# EAGLE design BEP3_RPM_BAR_multi (EAGLE 6.5.0)
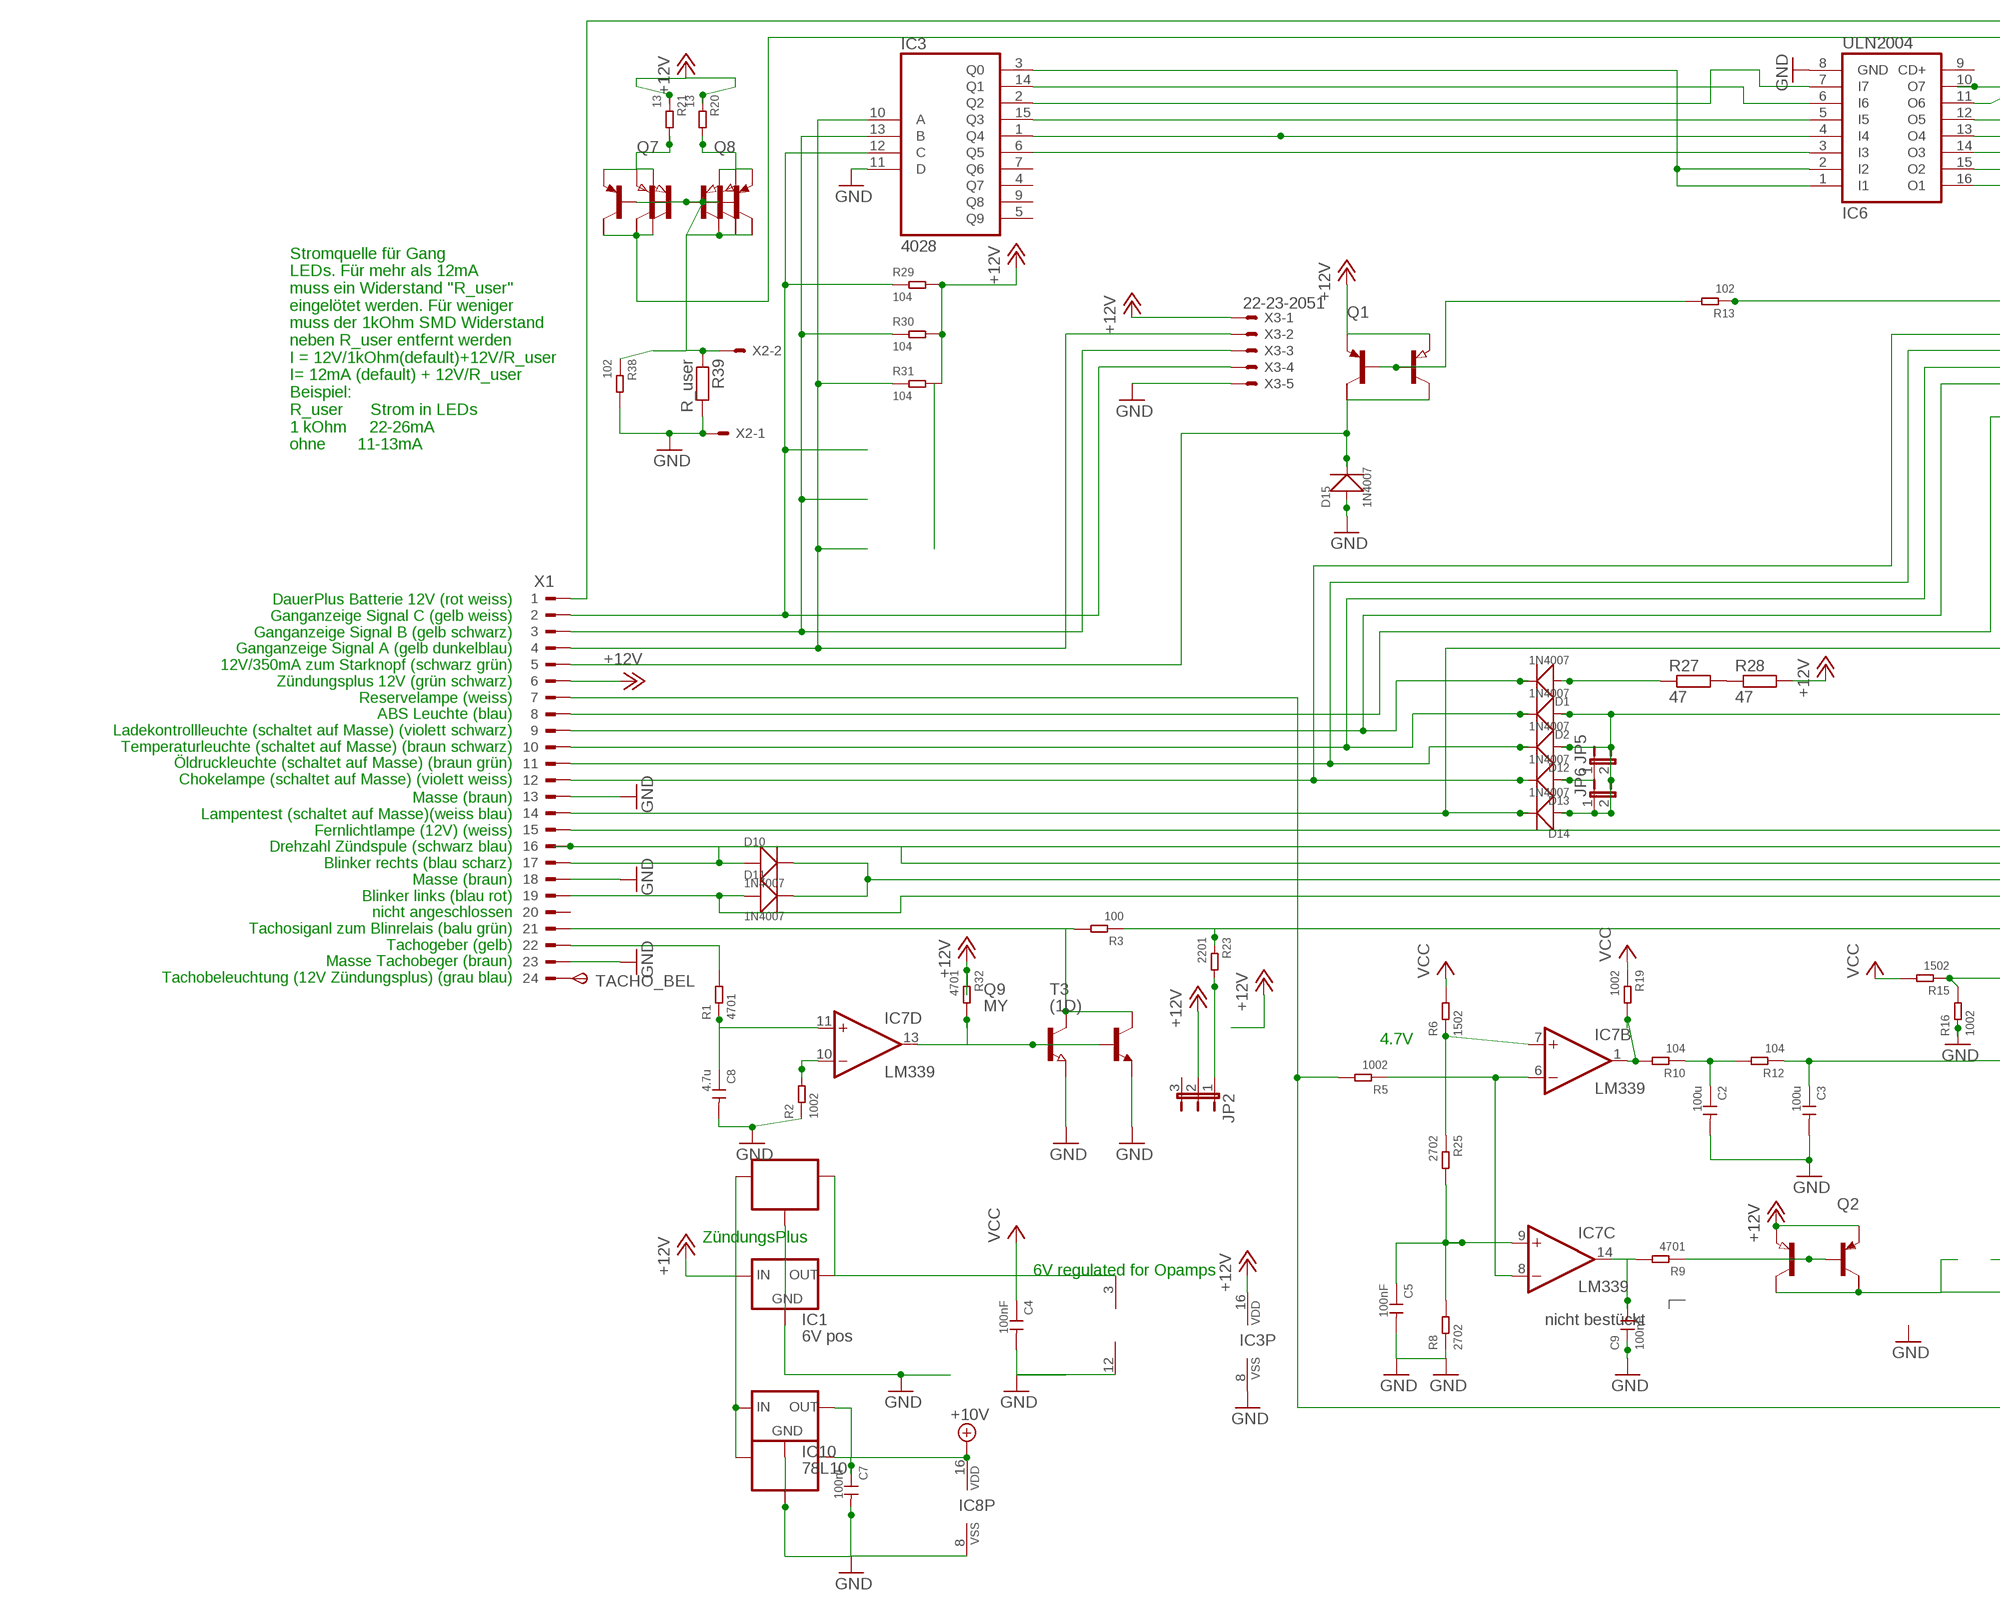
[diagram p0: schematic, sheet 1, part 1 of 2]
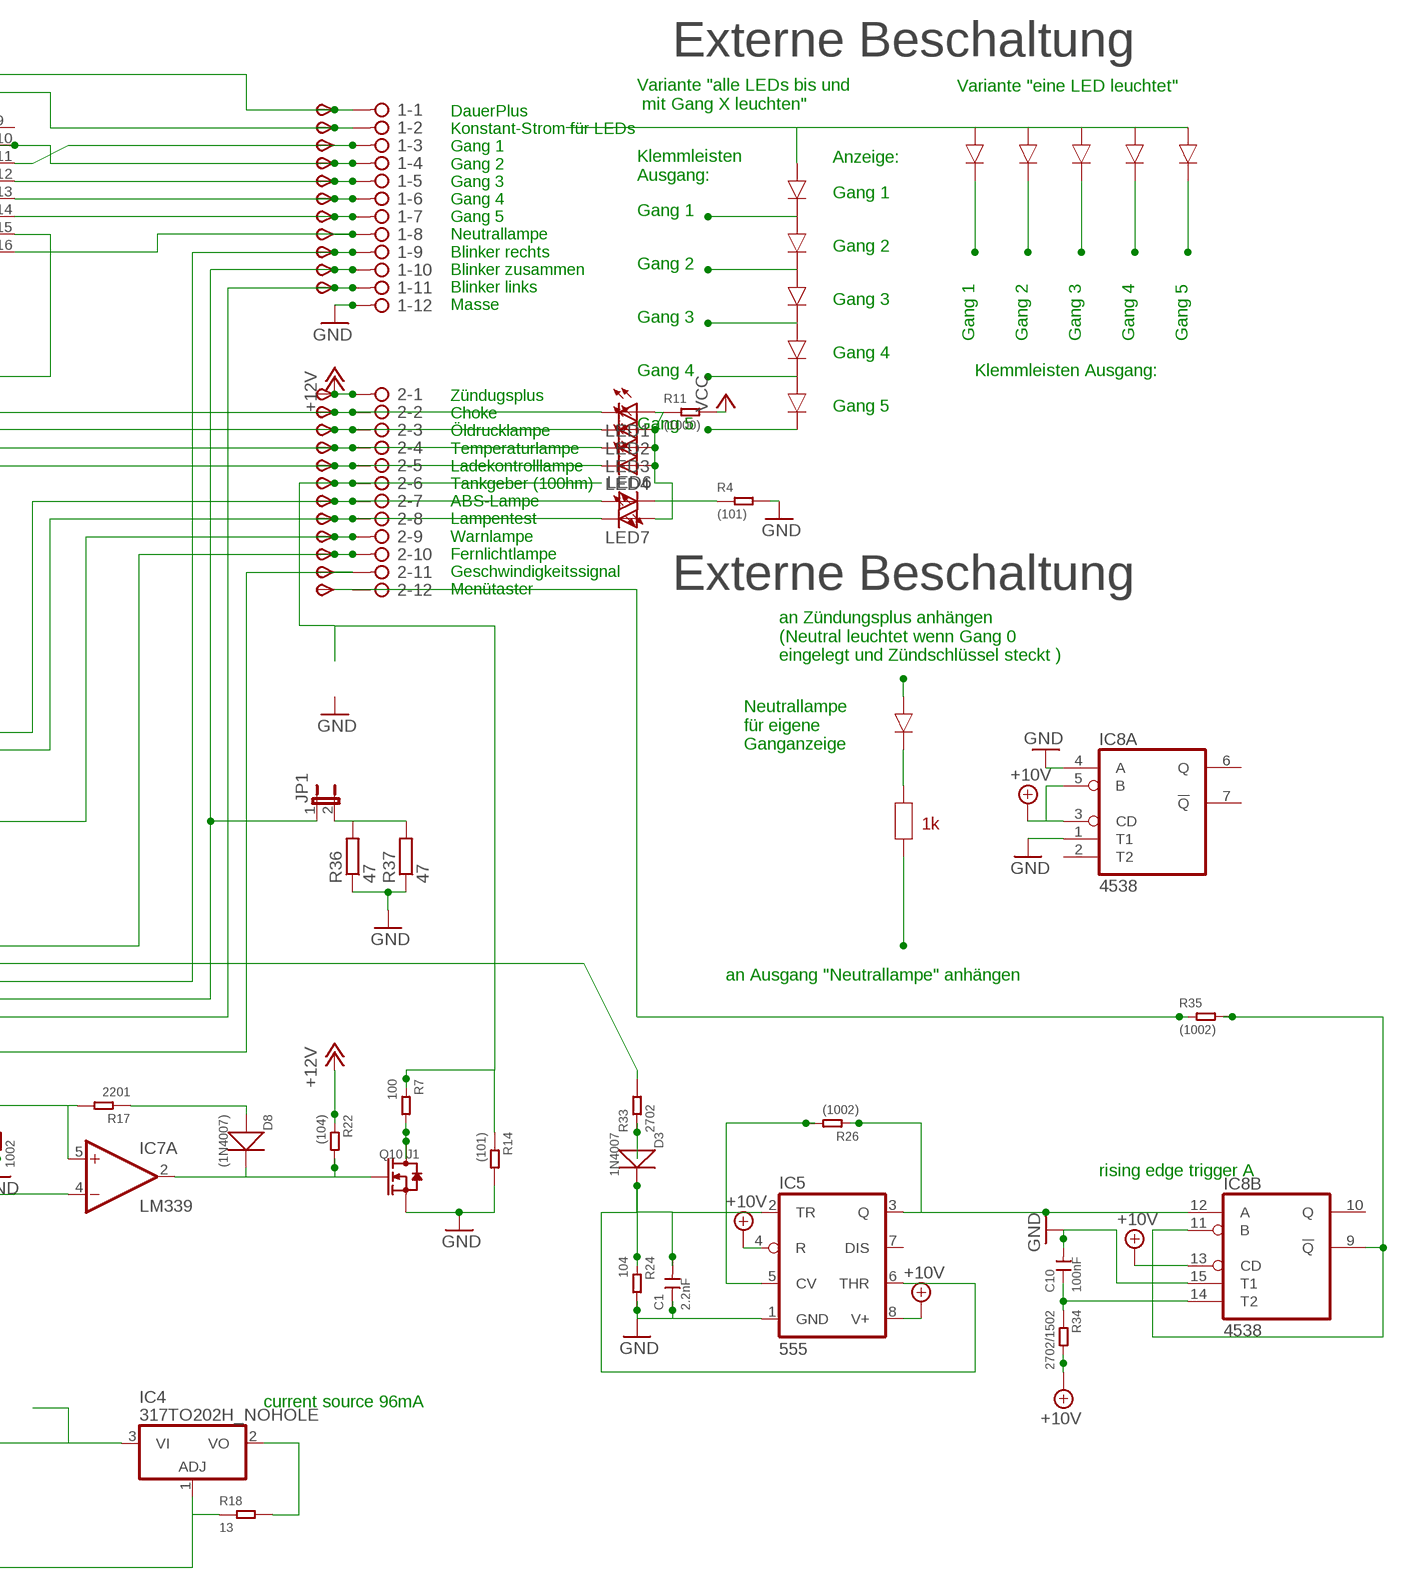
[diagram p1: schematic, sheet 1, part 2 of 2]

## Parts
1  2081-1132  [12-PIN]
2  2081-1132  [12-PIN]
C1  2.2nF  CERAMIC-100NF-50V-10%-X7R(0805)  [C0805]
C2  100u  CERAMIC-100UF-6.3V-20%-X5R(1206)  [C1206]
C3  100u  CERAMIC-100UF-6.3V-20%-X5R(1206)  [C1206]
C4  100nF  CERAMIC-100NF-50V-10%-X7R(0805)  [C0805]
C5  100nF  CERAMIC-100NF-50V-10%-X7R(0805)  [C0805]
C7  100nF  CERAMIC-100NF-50V-10%-X7R(0805)  [C0805]
C8  4.7u  CERAMIC-4.7UF-25V-10%-X5R(0805)  [C0805]
C9  100nF  CERAMIC-100NF-50V-10%-X7R(0805)  [C0805]
C10  100nF  CERAMIC-100NF-50V-10%-X7R(0805)  [C0805]
D1  1N4007  DIODE-GEN-PURPOSE-1KV-1A(DO-214AC)  [DO-214AC]
D2  1N4007  DIODE-GEN-PURPOSE-1KV-1A(DO-214AC)DO-214AC/1206  [DO-214AC-1206MOUNT]
D3  1N4007  DIODE-GEN-PURPOSE-1KV-1A(DO-214AC)  [DO-214AC]
D8  (1N4007)  DIODE-GEN-PURPOSE-1KV-1A(DO-214AC)DO-214AC/1206  [DO-214AC-1206MOUNT]
D10  1N4007  DIODE-GEN-PURPOSE-1KV-1A(DO-214AC)  [DO-214AC]
D11  1N4007  DIODE-GEN-PURPOSE-1KV-1A(DO-214AC)  [DO-214AC]
D12  1N4007  DIODE-GEN-PURPOSE-1KV-1A(DO-214AC)DO-214AC/1206  [DO-214AC-1206MOUNT]
D13  1N4007  DIODE-GEN-PURPOSE-1KV-1A(DO-214AC)DO-214AC/1206  [DO-214AC-1206MOUNT]
D14  1N4007  DIODE-GEN-PURPOSE-1KV-1A(DO-214AC)DO-214AC/1206  [DO-214AC-1206MOUNT]
D15  1N4007  DIODE-GEN-PURPOSE-1KV-1A(DO-214AC)  [DO-214AC]
IC1  6V pos  78LXX  [78LXX]
IC2  78LXX-SOT89  [SOT89]
IC3  4028  4028D  [SO16]
IC4  317TO202H_NOHOLE  [TO220H_NOHOLE]
IC5  555  NE555D  [SO08]
IC6  ULN2004  ULN2004AD  [SO16]
IC7  LM339  LM339D  [SO14]
IC8  4538  4538D  [SO16]
IC9  78LXX-SOT89  [SOT89]
IC10  78L10  78LXX  [78LXX]
JP1  JP1E  [JP1]
JP2  JP2E  [JP2]
JP5  JP1E  [JP1]
JP6  JP1E  [JP1]
LED1  LEDLD260  [LD260]
LED2  LEDLD260  [LD260]
LED3  LEDLD260  [LD260]
LED4  LEDLD260  [LD260]
LED6  LEDLD260  [LD260]
LED7  LEDLD260  [LD260]
Q1  PNP-TRANSISTOR_SOT89  [SOT89]
Q2  PNP-TRANSISTOR_SOT89  [SOT89]
Q3  AH-16  BCP53T1  [SOT223]
Q4  (AH-16)  BCP53T1  [SOT223]
Q5  (AH-16)  BCP53T1  [SOT223]
Q6  (AH-16)  BCP53T1  [SOT223]
Q7  PNP-TRANSISTOR_SOT89  [SOT89]
Q8  PNP-TRANSISTOR_SOT89  [SOT89]
Q9  MY  NPN-TRANSISTOR_SOT89  [SOT89]
Q10  J1  SMD-MOSFET-N-CH-50V-200MA-BSS138W-7-F(SOT-23)  [SOT-23]
R1  4701  SMD-RES-4.7K-5%-1/8W(0805)  [R0805]
R2  1002  SMD-RES-10K-1%-1/8W(0805)  [R0805]
R3  100  SMD-RES-220R-5%-1/8W(0805)  [R0805]
R4  (101)  SMD-RES-100R-5%-1/8W(0805)  [R0805]
R5  1002  SMD-RES-10K-1%-1/8W(0805)  [R0805]
R6  1502  SMD-RES-10K-1%-1/8W(0805)  [R0805]
R7  100  SMD-RES-2.2K-5%-1/8W(0805)  [R0805]
R8  2702  SMD-RES-4.7K-5%-1/8W(0805)  [R0805]
R9  4701  SMD-RES-4.7K-5%-1/8W(0805)  [R0805]
R10  104  SMD-RES-10K-1%-1/8W(0805)  [R0805]
R11  (1000)  SMD-RES-100R-5%-1/8W(0805)  [R0805]
R12  104  SMD-RES-10K-1%-1/8W(0805)  [R0805]
R13  102  SMD-RES-1K-5%-1/8W(0805)  [R0805]
R14  (101)  SMD-RES-2.2K-5%-1/8W(0805)  [R0805]
R15  1502  SMD-RES-10K-1%-1/8W(0805)  [R0805]
R16  1002  SMD-RES-10K-1%-1/8W(0805)  [R0805]
R17  2201  SMD-RES-2.2K-5%-1/8W(0805)  [R0805]
R18  13  SMD-RES-13R-5%-1/4W(1206)  [R1206]
R19  1002  SMD-RES-10K-1%-1/8W(0805)  [R0805]
R20  13  SMD-RES-13R-5%-1/4W(1206)  [R1206]
R21  13  SMD-RES-13R-5%-1/4W(1206)  [R1206]
R22  (104)  SMD-RES-10K-1%-1/8W(0805)  [R0805]
R23  2201  SMD-RES-2.2K-5%-1/8W(0805)  [R0805]
R24  104  SMD-RES-10K-1%-1/8W(0805)  [R0805]
R25  2702  SMD-RES-4.7K-5%-1/8W(0805)  [R0805]
R26  (1002)  SMD-RES-10K-1%-1/8W(0805)  [R0805]
R27  47  R-EU_V235/17_1MM  [V235/17_1MM]
R28  47  R-EU_V235/17_1MM  [V235/17_1MM]
R29  104  SMD-RES-10K-1%-1/8W(0805)  [R0805]
R30  104  SMD-RES-10K-1%-1/8W(0805)  [R0805]
R31  104  SMD-RES-10K-1%-1/8W(0805)  [R0805]
R32  4701  SMD-RES-4.7K-5%-1/8W(0805)  [R0805]
R33  2702  SMD-RES-10K-1%-1/8W(0805)  [R0805]
R34  2702/1502  SMD-RES-4.7K-5%-1/8W(0805)  [R0805]
R35  (1002)  SMD-RES-4.7K-5%-1/8W(0805)  [R0805]
R36  47  R-EU_V235/17_1MM  [V235/17_1MM]
R37  47  R-EU_V235/17_1MM  [V235/17_1MM]
R38  102  SMD-RES-1K-5%-1/8W(0805)  [R0805]
R39  R_user  R-EU_R0805  [R0805]
T1  PNP2SM8  [SM8]
T3  (1D)  MMBTA42LT1-NPN-SOT23-BEC  [SOT23-BEC]
TACHO_BEL  TPSP1_1MM  [P1_1.0MM]
TP1  TPSB1.8  [B1.8]
TP2  TPSB1.8  [B1.8]
TP3  TPSB1.8  [B1.8]
TP4  TPSB1.8  [B1.8]
TP5  TPSB1.8  [B1.8]
TP6  TPSB1.8  [B1.8]
TP7  TPSB1.8  [B1.8]
TP8  TPSB1.8  [B1.8]
TP9  TPSB1.8  [B1.8]
TP10  TPSB1.8  [B1.8]
TP11  TPSB1.8  [B1.8]
TP12  TPSB1.8  [B1.8]
TP13  TPSB1,27  [B1,27]
TP16  TPSB1.8  [B1.8]
TP17  TPSB1.8  [B1.8]
TP18  TPSB1.8  [B1.8]
TP19  TPSB1.8  [B1.8]
TP21  TPSB1.8  [B1.8]
TP22  TPSB1.8  [B1.8]
TP23  TPSB1.8  [B1.8]
TP24  TPSB1,27  [B1,27]
TP25  TPSB1.8  [B1.8]
TP26  TPSB1.8  [B1.8]
X1  CON_BMWV2  [24-PIN_V2]
X2  22-23-2021  [22-23-2021]
X3  22-23-2051  [22-23-2051]

## Nets
+10V: C7.1 IC5.4(R) IC5.8(V+) IC8.3(A:CD) IC8.5(A:B) IC8.13(B:CD) IC8.16(P:VDD) IC9.1(OUT) IC10.OUT R34.2
+12V: 2.1 IC1.IN IC2.3(IN) IC3.16(VDD) IC9.3(IN) IC10.IN JP2.2 Q1.3(E) Q2.3(E) Q3.3(E) Q4.3(E) R20.1 R21.1 R22.1 R28.2 R29.2 R30.2 R31.2 R32.1 TP12.TP(PP) X1.6 X3.1
GND: 1.12 C1.1 C2.2 C3.2 C4.2 C5.2 C7.2 C8.2 C9.1 C10.2 D15.1(+) IC1.GND IC2.2(GND) IC2.4(GND) IC3.8(VSS) IC3.11(D) IC5.1(GND) IC6.8(GND) IC7.12(P:GND) IC8.1(A:T1) IC8.4(A:A) IC8.8(P:VSS) IC8.15(B:T1) IC9.2(GND) IC9.4(GND) IC10.GND Q9.3(E) Q10.2(S) R2.1 R4.2 R8.1 R14.2 R16.1 R24.2 R36.1 R37.1 R38.2 R39.2 T3.E X1.13 X1.18 X1.23 X2.1 X3.5
N$1: 2.9 D2.1(+) D12.1(+) D14.1(+) JP5.2 JP6.1 JP6.2 TP24.TP(PP)
N$2: IC3.10(A) R31.1 X1.4 X3.2
N$3: IC3.13(B) R30.1 X1.3 X3.3
N$4: 2.7 LED6.A TP22.TP(PP) X1.8
N$5: Q5.3(E) Q8.3(E) R21.2 T1.1(B:E)
N$6: D8.2(-) IC7.2(A:OUT) Q10.1(G) R22.2
N$7: IC7.10(D:-IN) R2.2
N$8: R27.2 R28.1
N$9: Q6.3(E) Q7.3(E) R20.2 T1.3(A:E)
N$11: D15.2(-) Q1.2(C) Q3.2(C) X1.5
N$12: 2.2 D13.2(-) LED1.K(C) TP16.TP(PP) X1.12
N$13: 2.3 D12.2(-) LED2.K(C) TP17.TP(PP) X1.11
N$14: 2.4 D2.2(-) LED3.K(C) TP18.TP(PP) X1.10
N$15: IC4.3(VI) Q2.2(C) Q4.2(C)
N$16: IC7.6(B:-IN) IC7.8(C:-IN) R5.1
N$17: IC3.12(C) R29.1 X1.2 X3.4
N$18: IC3.15(Q3) IC6.5(I5)
N$19: 2.8 D14.2(-) LED7.K(C) TP23.TP(PP) X1.14
N$20: 1.9 D10.1(+) TP9.TP(PP) X1.17
N$21: 1.11 D11.1(+) TP11.TP(PP) X1.19
N$22: IC8.9(B:!Q) IC8.11(B:B) R35.2
N$23: R1.2 X1.22
N$24: C8.1 IC7.11(D:+IN) R1.1
N$25: 1.6 IC6.13(O4) TP6.TP(PP)
N$26: 1.7 IC6.14(O3) TP7.TP(PP)
N$27: 2.11 R3.1 R23.1 TP26.TP(PP)
N$28: 2.6 R7.1 R14.1 TP21.TP(PP)
N$29: JP2.1 R23.2
N$30: C5.1 IC7.9(C:+IN) R8.2 R25.2
N$31: C9.2 IC7.14(C:OUT) R9.2
N$32: C1.2 D3.2(-) IC5.2(TR) IC5.6(THR) R24.1
N$34: LED6.K(C) R4.1
N$35: IC4.1(ADJ) R5.2 R18.1 X1.7
N$36: Q2.1(B) Q4.1(B) R9.1
N$37: IC3.2(Q2) IC6.7(I7)
N$38: 1.3 IC6.11(O6) TP3.TP(PP)
N$39: 1.5 IC6.12(O5) TP5.TP(PP)
N$41: LED1.A LED2.A LED3.A LED4.A LED7.A R11.1
N$42: R33.2 X1.16
N$43: Q1.1(B) Q3.1(B) R13.2
N$44: IC3.3(Q0) IC6.1(I1) IC6.2(I2)
N$45: C2.1 R10.1 R12.2
N$46: C3.1 IC7.4(A:-IN) R12.1
N$47: IC7.5(A:+IN) R15.1 R16.2 R17.2
N$48: Q10.3(D) R7.2
N$49: D8.1(+) R17.1
N$50: IC3.1(Q4) IC6.4(I4)
N$52: 1.8 IC6.16(O1) TP8.TP(PP)
N$53: 2.10 TP25.TP(PP) X1.15
N$54: D1.1(+) R27.1
N$55: 2.5 D1.2(-) LED4.K(C) TP19.TP(PP) X1.9
N$56: IC3.14(Q1) IC6.6(I6)
N$57: Q5.1(B) Q6.1(B) Q6.2(C) Q7.1(B) Q7.2(C) Q8.1(B) R38.1 R39.1 T1.2(B:B) T1.4(A:B) T1.6(A:C1) X2.2
N$58: TACHO_BEL.TP(PP) X1.24
N$59: 1.2 Q5.2(C) Q8.2(C) T1.8(B:C1) TP2.TP(PP)
N$61: IC3.6(Q5) IC6.3(I3)
N$64: IC4.2(VO) R18.2
N$65: IC5.5(CV) R26.2
N$67: 1.4 IC6.10(O7) TP4.TP(PP)
N$69: 1.1 TP1.TP(PP) X1.1
N$83: IC7.7(B:+IN) R6.1 R25.1
N$84: Q9.2(C) R3.2 T3.C X1.21
N$85: IC7.13(D:OUT) Q9.1(B) R32.2 T3.B
N$86: IC5.3(Q) IC8.12(B:A) R26.1
N$87: D3.1(+) R33.1
N$88: IC6.15(O2) R13.1
N$89: C10.1 IC8.14(B:T2) R34.1
N$90: 2.12 R35.1 TP13.TP(PP)
N$93: 1.10 D10.2(-) D11.2(-) JP1.1 TP10.TP(PP)
N$94: JP1.2 R36.2 R37.2
N$95: D13.1(+) JP5.1
N$580: IC7.1(B:OUT) R10.2 R19.2
VCC: C4.1 IC1.OUT IC2.1(OUT) IC7.3(P:V+) R6.2 R11.2 R15.2 R19.1
Unconnected: IC3.4(Q7) IC3.5(Q9) IC3.7(Q6) IC3.9(Q8) IC5.7(DIS) IC6.9(CD+) IC8.2(A:T2) IC8.6(A:Q) IC8.7(A:!Q) IC8.10(B:Q) JP2.3 Q3.4(C/) Q4.4(C/) Q5.4(C/) Q6.4(C/) T1.5(A:C) T1.7(B:C) X1.20

## Notes on the sheet
- Externe Beschaltung
- Variante "eine LED leuchtet"
- Variante "alle LEDs bis und
   mit Gang X leuchten"
- Anzeige:
- Klemmleisten
  Ausgang:
- Gang 1
- DauerPlus
  Konstant-Strom für LEDs
  Gang 1
  Gang 2
  Gang 3
  Gang 4
  Gang 5
  Neutrallampe
  Blinker rechts
  Blinker zusammen
  Blinker links
  Masse
- Gang 1
- Gang 2
- Gang 2
- Gang 3
- Gang 3
- Gang 1 | Gang 2 | Gang 3 | Gang 4 | Gang 5
- Gang 4
- Gang 4 | Klemmleisten Ausgang:
- Gang 5
- Gang 5
- Zündugsplus
  Choke
  Öldrucklampe
  Temperaturlampe
  Ladekontrolllampe
  Tankgeber (100hm)
  ABS-Lampe
  Lampentest
  Warnlampe
  Fernlichtlampe
  Geschwindigkeitssignal
  Menütaster
- Stromquelle für Gang
  LEDs. Für mehr als 12mA
  muss ein Widerstand "R_user"
  eingelötet werden. Für weniger
  muss der 1kOhm SMD Widerstand
  neben R_user entfernt werden
  I = 12V/1kOhm(default)+12V/R_user
  I= 12mA (default) + 12V/R_user
  Beispiel:
  R_user      Strom in LEDs
  1 kOhm     22-26mA
  ohne       11-13mA
- Externe Beschaltung
- an Zündungsplus anhängen
  (Neutral leuchtet wenn Gang 0
  eingelegt und Zündschlüssel steckt )
- Neutrallampe
  für eigene
  Ganganzeige
- DauerPlus Batterie 12V (rot weiss)
  Ganganzeige Signal C (gelb weiss)
  Ganganzeige Signal B (gelb schwarz)
  Ganganzeige Signal A (gelb dunkelblau)
  12V/350mA zum Starknopf (schwarz grün)
  Zündungsplus 12V (grün schwarz)
  Reservelampe (weiss)
  ABS Leuchte (blau)
  Ladekontrollleuchte (schaltet auf Masse) (violett schwarz)
  Temperaturleuchte (schaltet auf Masse) (braun schwarz)
  Öldruckleuchte (schaltet auf Masse) (braun grün)
  Chokelampe (schaltet auf Masse) (violett weiss)
- 1k
- an Ausgang "Neutrallampe" anhängen
- Masse (braun)
  Lampentest (schaltet auf Masse)(weiss blau)
  Fernlichtlampe (12V) (weiss)
  Drehzahl Zündspule (schwarz blau)
  Blinker rechts (blau scharz)
  Masse (braun)
  Blinker links (blau rot)
  nicht angeschlossen
  Tachosiganl zum Blinrelais (balu grün)
  Tachogeber (gelb)
  Masse Tachobeger (braun)
  Tachobeleuchtung (12V Zündungsplus) (grau blau)
- 4.7V | rising edge trigger A
- ZündungsPlus
- current source 96mA
- 6V regulated for Opamps
- nicht bestückt

## Library data of the parts
1 2 = con WAGO BMW:2081-1132: WAGO SREW CLAMP
C1 C4 C5 C7 C9 C10 = Seeed-Capacitor-2016:CERAMIC-100NF-50V-10%-X7R(0805): 302010165; MPN: CC0805KRX7R9BB104; VALUE: 100nf
C2 C3 = Seeed-Capacitor-2016:CERAMIC-100UF-6.3V-20%-X5R(1206): 302010183; MPN: GRM31CR60J107ME39L; VALUE: 100uf
C8 = Seeed-Capacitor-2016:CERAMIC-4.7UF-25V-10%-X5R(0805): 302010146; MPN: CC0805KKX5R8BB475; VALUE: 4.7uf
D1 D3 D10 D11 D15 = Diode-do214ac:DIODE-GEN-PURPOSE-1KV-1A(DO-214AC): 304010013; MPN: 1N4007
D2 D8 D12-D14 = Diode-do214ac:DIODE-GEN-PURPOSE-1KV-1A(DO-214AC): 304010013
IC1 IC10 = v-reg:78LXX: VOLTAGE REGULATOR
IC2 IC9 = 78LXX:78LXX
IC3 = 4028:4028: BCD to decimal DECODER
IC4 = linear_BMW:*317: Positive VOLTAGE REGULATOR
IC5 = linear:*555: TIMER
IC6 = uln-udn:ULN2004A: DRIVER ARRAY
IC7 = LM339:LM339: Low Power Low Offset Voltage Quad Comparators with open collector; LM139/LM239/LM339/LM2901/LM3302
IC8 = 45xx:4538: Dual precision monostable MULTIVIBRATOR
JP1 JP5 JP6 = jumper:JP1E: JUMPER
JP2 = jumper:JP2E: JUMPER
LED1-LED4 LED6 LED7 = led:LED: LED OSRAM: - CHIPLED LG R971, LG N971, LY N971, LG Q971, LY Q971, LO R971, LY R971 LH N974, LH R974 LS Q976, LO Q976, LY Q976 LO Q996 - Hyper CHIPLED LW Q18S LB Q993, LB Q99A, LB R99A - SideLED LS A670, LO A670, LY A670, LG A670, LP A670 LB A673, LV A673, LT A673, LW A673 LH A674 LY A675 LS A676, LA A676, LO A676, LY A676, LW A676 LS A679, LY A679, LG A679 - Hyper Micro SIDELED® LS Y876, LA Y876, LO Y876, LY Y876 LT Y87S - SmartLED LW L88C, LW L88S LB L89C, LB L89S, LG L890 LS L89K, LO L89K, LY L89K LS L896, LA L896, LO L896, LY L896 - TOPLED LS T670, LO T670, LY T670, LG T670, LP T670 LSG T670, LSP T670, LSY T670, LOP T670, LYG T670 LG T671, LOG T671, LSG T671 LB T673, LV T673, LT T673, LW T673 LH T674 LS T676, LA T676, LO T676, LY T676, LB T676, LH T676, LSB T676, LW T676 LB T67C, LV T67C, LT T67C, LS T67K, LO T67K, LY T67K, LW E67C LS E67B, LA E67B, LO E67B, LY E67B, LB E67C, LV E67C, LT E67C LW T67C LS T679, LY T679, LG T679 LS T770, LO T770, LY T770, LG T770, LP T770 LB T773, LV T773, LT T773, LW T773 LH T774 LS E675, LA E675, LY E675, LS T675 LS T776, LA T776, LO T776, LY T776, LB T776 LHGB T686 LT T68C, LB T68C - Hyper Mini TOPLED® LB M676 - Mini TOPLED Santana® LG M470 LS M47K, LO M47K, LY M47K Source: http://www.osram.convergy.de LUXEON: - LUMILED® LXK2-PW12-R00, LXK2-PW12-S00, LXK2-PW14-U00, LXK2-PW14-V00 LXK2-PM12-R00, LXK2-PM12-S00, LXK2-PM14-U00 LXK2-PE12-Q00, LXK2-PE12-R00, LXK2-PE12-S00, LXK2-PE14-T00, LXK2-PE14-U00 LXK2-PB12-K00, LXK2-PB12-L00, LXK2-PB12-M00, LXK2-PB14-N00, LXK2-PB14-P00, LXK2-PB14-Q00 LXK2-PR12-L00, LXK2-PR12-M00, LXK2-PR14-Q00, LXK2-PR14-R00 LXK2-PD12-Q00, LXK2-PD12-R00, LXK2-PD12-S00 LXK2-PH12-R00, LXK2-PH12-S00 LXK2-PL12-P00, LXK2-PL12-Q00, LXK2-PL12-R00 Source: www.luxeon.com KINGBRIGHT: KA-3528ASYC Source: www.kingbright.com
Q1 Q2 Q7 Q8 = Transistor_SOT89:PNP-TRANSISTOR_: PNP TRANSISTOR
Q3-Q6 = BCP53_:BCP53*
Q9 = Transistor_SOT89:NPN-TRANSISTOR_: NPN TRANSISTOR
Q10 = Seeed-Transistor-2016:SMD-MOSFET-N-CH-50V-200MA-BSS138W-7-F(SOT-23): 305030000; MPN: BSS138W-7-F; VALUE: BSS138W-7-F
R1 R8 R9 R25 R32 R34 R35 = Seeed-Resistor-2016:SMD-RES-4.7K-5%-1/8W(0805): 301010306; MPN: RC0805JR-074K7L; VALUE: 4.7K
R2 R5 R6 R10 R12 R15 R16 R19 R22 R24 R26 R29-R31 R33 = Seeed-Resistor-2016:SMD-RES-10K-1%-1/8W(0805): 301010361; MPN: RC0805FR-0710KL; VALUE: 10K
R3 = Seeed-Resistor-2016:SMD-RES-220R-5%-1/8W(0805): 301010315; MPN: RC0805JR-07220RL; VALUE: 220R
R4 R11 = Seeed-Resistor-2016:SMD-RES-100R-5%-1/8W(0805): 301010319; MPN: RC0805JR-07100RL; VALUE: 100R
R7 R14 R17 R23 = Seeed-Resistor-2016:SMD-RES-2.2K-5%-1/8W(0805): 301010333; MPN: RC0805JR-072K2L; VALUE: 2.2K
R13 R38 = Seeed-Resistor-2016:SMD-RES-1K-5%-1/8W(0805): 301010311; MPN: RC0805JR-071KL; VALUE: 1K
R18 R20 R21 = Seeed-Resistor-2016:SMD-RES-13R-5%-1/4W(1206): 301010405; MPN: RC1206JR-0713RL; VALUE: 13R
R27 R28 R36 R37 R39 = rcl:R-EU_: RESISTOR, European symbol
T1 = PNP2SM8:PNP2SM8; OC_FARNELL: unknown; OC_NEWARK: unknown
T3 = transistor:*-NPN-: NPN Transistror BF959 corrected 2008.03.06
TACHO_BEL TP1-TP13 TP16-TP19 TP21-TP26 = testpin_BMW:TPS: TEST PIN
X1 = con_BMW:CON_BMW: BMW CONNECTOR
X2 = con_Molex_BMW:22-23-2021: .100" (2.54mm) Center Header - 2 Pin; MF: MOLEX; MPN: 22-23-2021; OC_FARNELL: 1462926; OC_NEWARK: 25C3832
X3 = con_Molex_BMW:22-23-2051: .100" (2.54mm) Center Header - 5 Pin; MF: MOLEX; MPN: 22-23-2051; OC_FARNELL: 1462952; OC_NEWARK: 38C9178

## Board
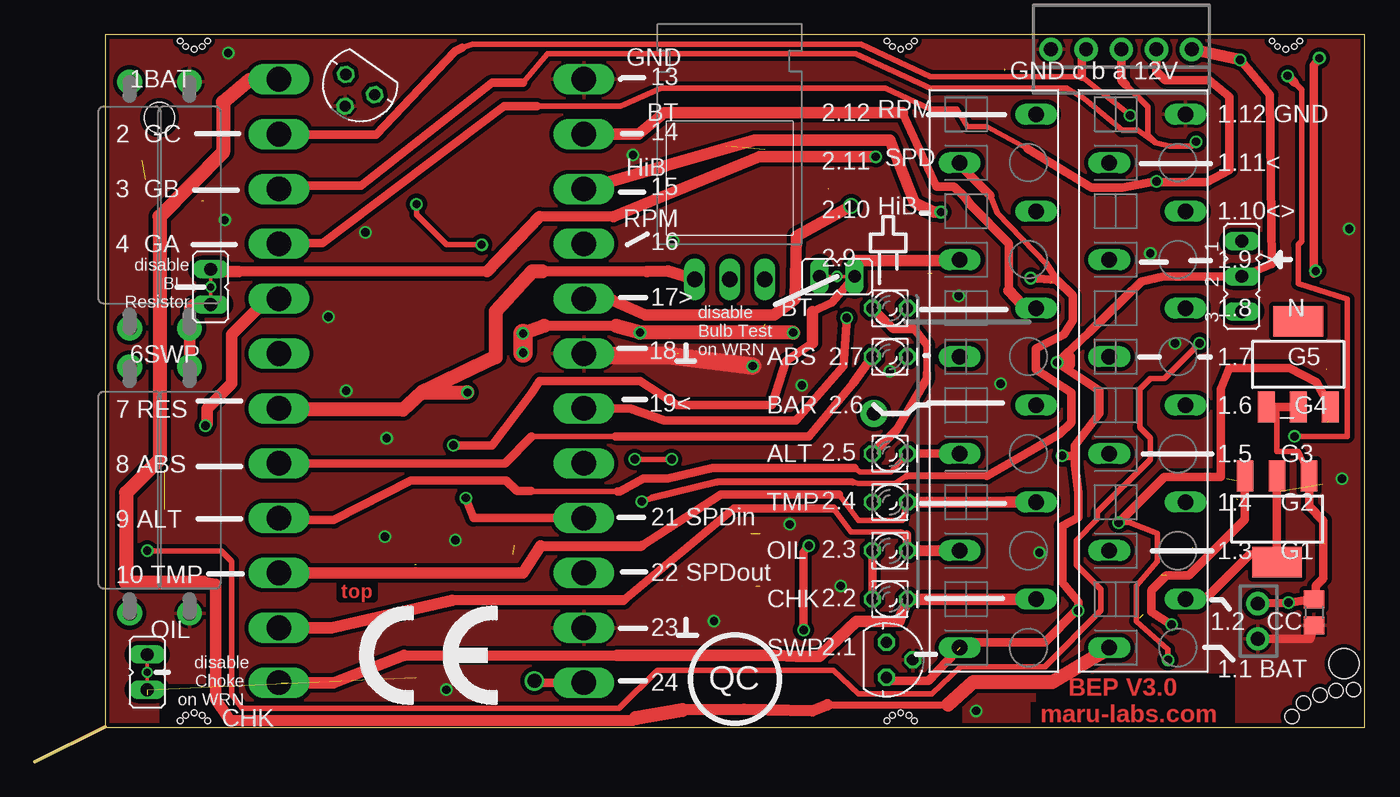
[diagram p2: board, top side]
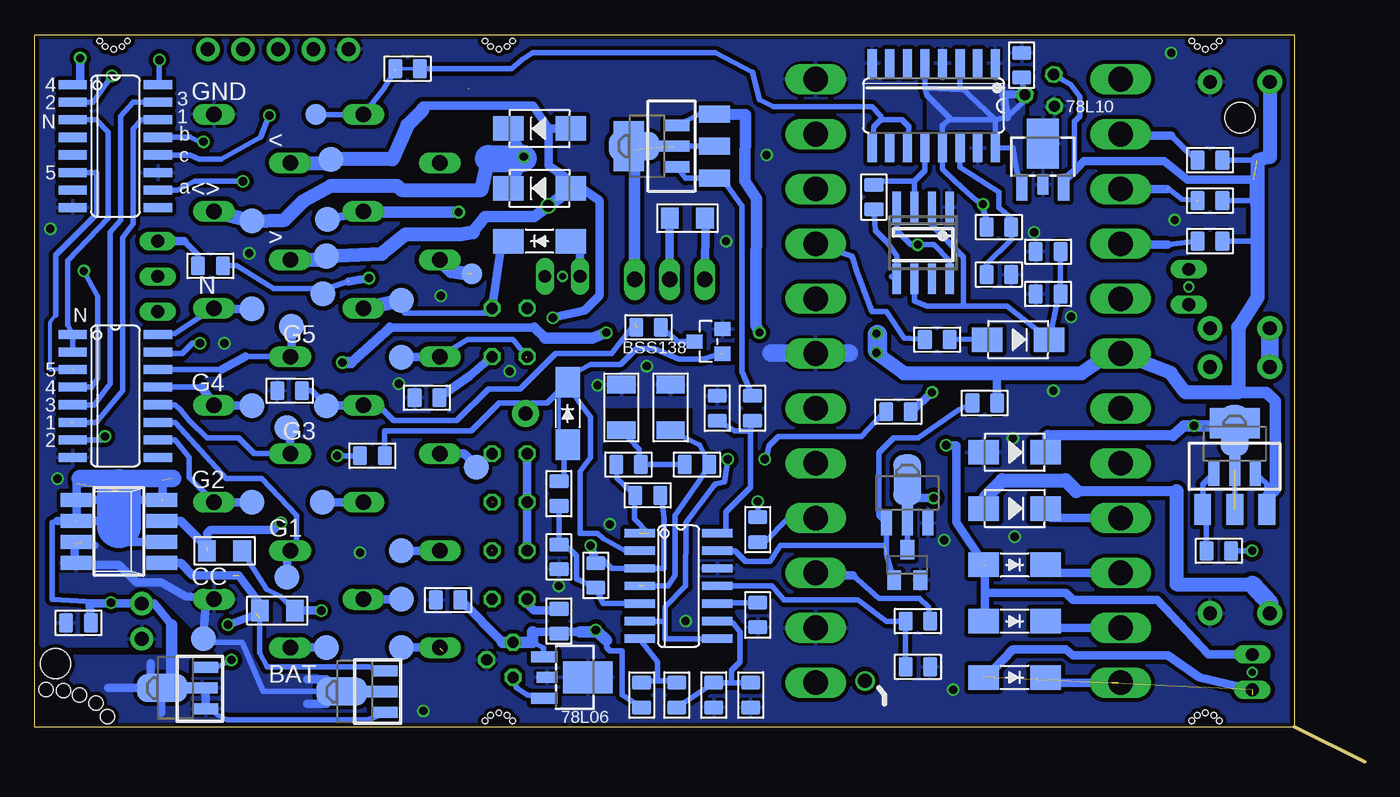
[diagram p3: board, bottom side, seen from below]

Size 96 x 52.5 mm. Coordinates in mm from the lower left corner, seen from the top.
Outline: 5.08,2.54 5.08,52.5 96,52.5 96,2.5 5.08,2.5 5.08,2.54
Outline: 0,0 5.08,2.54
Copper layers (1*16): Top 0.035mm / dielectric 1.5mm / Bottom 0.035mm
Design rules "multi-cb_035um-cu *": minimum track width 6mil, minimum drill 12mil, track to track 12mil, track to pad 12mil, pad to pad 6mil, via to via 6mil, smd to smd 6mil, copper to edge 12mil, drill to drill 8mil, minimum pad ring 8mil, minimum via ring 6mil, stop-mask expansion 3mil, vias tented up to drill 0mil, thermal gap 8mil
Holes 1.02 mm at 95.19,5.21 93.92,5.14 92.77,4.83 91.57,4.25 90.76,3.27
Holes 2.18 mm at 94.5,7.1 9,46.5
Holes 0.4 mm at 62.5,3.56 61.9,3.36 61.5,2.96 63.1,3.36 63.5,2.96 11.5,3.56 10.9,3.36 10.5,2.96 12.1,3.36 12.5,2.96 11.5,51.44 12.1,51.64 12.5,52.04 10.9,51.64 10.5,52.04 62.5,51.44 63.1,51.64 63.5,52.04 61.9,51.64 61.5,52.04 90.3,51.44 90.9,51.64 91.3,52.04 89.7,51.64 89.3,52.04
tRestrict: area 76.4,2.8 to 86.6,6.3; area 71.9,2.8 to 76.5,4.3; area 6.9,6 to 9.3,7; area 11.7,33.8 to 13.8,34.8; area 59.9,2.9 to 66.9,3.8; area 9,2.7 to 14.1,5; area 9,2.5 to 14.2,5.6
bRestrict: area 48.5,22.2 to 55,25.5; area 32.6,12.7 to 33.3,13.6; area 6.9,6 to 9.3,7; area 11.7,33.8 to 13.8,34.8

### Footprints (pad centres in the part's own frame; a part is rotated, then mirrored left to right if it is on the bottom)
12-PIN = drill 1.118 long: 1 19.25,-2.45; 2 15.75,3.05; 3 12.25,-2.45; 4 8.75,3.05; 5 5.25,-2.45; 6 1.75,3.05; 7 -1.75,-2.45; 8 -5.25,3.05; 9 -8.75,-2.45; 10 -12.25,3.05; 11 -15.75,-2.45; 12 -19.25,3.05
C0805 = smd 1.397 x 1.016: 1 0,0.889; 2 0,-0.889
C1206 = smd 1.27 x 2.032: 1 -1.651,0; 2 1.651,0
DO-214AC = smd 2.2 x 1.77: 1 -2.242,0; 2 2.242,0
DO-214AC-1206MOUNT = smd 2.2 x 1.77: 1 -2.242,0; 2 2.242,0
78LXX = drill 0.813 octagon: GND 0,1.905; IN 1.27,0; OUT -1.27,0
SOT89 = smd 0.8 x 1.9: 1 -1.5,-1.95; 3 1.5,-1.95 | smd 0.8 x 1.5: 2 0,-1.75 | smd 2.3 x 3.6: 4 0,1.2
SO16 = smd 0.66 x 2.032: 1 -4.445,-3.073; 2 -3.175,-3.073; 3 -1.905,-3.073; 4 -0.635,-3.073; 5 0.635,-3.073; 6 1.905,-3.073; 7 3.175,-3.073; 8 4.445,-3.073; 9 4.445,3.073; 10 3.175,3.073; 11 1.905,3.073; 12 0.635,3.073; 13 -0.635,3.073; 14 -1.905,3.073; 15 -3.175,3.073; 16 -4.445,3.073
TO220H_NOHOLE = drill 1.118 long: 1 -2.54,-10.16; 2 0,-10.16; 3 2.54,-10.16
SO08 = smd 0.6 x 2.2: 1 -1.905,-2.6; 2 -0.635,-2.6; 3 0.635,-2.6; 4 1.905,-2.6; 5 1.905,2.6; 6 0.635,2.6; 7 -0.635,2.6; 8 -1.905,2.6
SO14 = smd 0.6 x 2.2: 1 -3.81,-2.8; 2 -2.54,-2.8; 3 -1.27,-2.8; 4 0,-2.8; 5 1.27,-2.8; 6 2.54,-2.8; 7 3.81,-2.8; 8 3.81,2.8; 9 2.54,2.8; 10 1.27,2.8; 11 0,2.8; 12 -1.27,2.8; 13 -2.54,2.8; 14 -3.81,2.8
JP1 = drill 0.914 long: 1 0,-1.27; 2 0,1.27
JP2 = drill 0.914 long: 1 -2.54,0; 2 0,0; 3 2.54,0
LD260 = drill 0.813 octagon: A -1.27,0; K 1.27,0
SOT89' = smd 0.8 x 1.8: 1 -1.499,-2.181; 3 1.499,-2.181 | smd 0.8 x 2.3: 2 0,-1.927 | smd 2.032 x 3.65: 2@1 0,0.94
SOT223 = smd 1.219 x 2.235: 1 -2.311,-3.099; 2 0,-3.099; 3 2.311,-3.099 | smd 3.6 x 2.2: 4 0,3.099
SOT-23 = smd 1.016 x 1.143: 1 -0.889,-1.016; 2 0.889,-1.016; 3 0,1.016
R0805 = smd 1.397 x 1.016: 1 0,0.889; 2 0,-0.889
R1206 = smd 1.27 x 1.524: 1 -1.27,0; 2 1.27,0
V235/17_1MM = drill 1 pad 1.778: 1 -8.89,0; 2 8.89,0
R0805' = smd 1.3 x 1.5: 1 -0.95,0; 2 0.95,0
SM8 = smd 1.016 x 2.235: 1 -2.286,-3.099; 2 -0.762,-3.099; 3 0.762,-3.099; 4 2.286,-3.099; 5 2.286,3.099; 6 0.762,3.099; 7 -0.762,3.099; 8 -2.286,3.099
SOT23-BEC = smd 1 x 1.4: B -0.95,-1.1; C 0,1.1; E 0.95,-1.1
P1_1.0MM = drill 1.016: TP 0,0
B1.8 = smd 1.8 x 1.8: TP 0,0
B1,27 = smd 1.5 x 1.5: TP 0,0
24-PIN_V2 = drill 1.778 long: 1 -21.78,-11; 2 -17.82,-11; 3 -13.86,-11; 4 -9.9,-11; 5 -5.94,-11; 6 -1.98,-11; 7 1.98,-11; 8 5.94,-11; 9 9.9,-11; 10 13.86,-11; 11 17.82,-11; 12 21.78,-11; 13 -21.78,11; 14 -17.82,11; 15 -13.86,11; 16 -9.9,11; 17 -5.94,11; 18 -1.98,11; 19 1.98,11; 20 5.94,11; 21 9.9,11; 22 13.86,11; 23 17.82,11; 24 21.78,11
22-23-2021 = drill 1 pad 1.676: 1 -1.27,0; 2 1.27,0
22-23-2051 = drill 1 pad 1.676: 1 -5.08,0; 2 -2.54,0; 3 0,0; 4 2.54,0; 5 5.08,0

### Placement (x,y rotation side)
1  80.01,27.5 270 top
2  69.22,27.5 270 top
C1  22.86,33.78 90 bottom
C2  53.66,25.59 90 bottom
C3  50.1,25.59 90 bottom
C4  66.17,11.68 270 bottom
C5  46.99,4.83 0 bottom
C7  24.77,50.29 180 bottom
C8  32.26,6.86 90 bottom
C9  46.74,25.53 0 bottom
C10  26.42,35.18 90 bottom
D1  25.27,18.29 0 bottom
D2  25.27,14.22 0 bottom
D3  25.02,30.48 0 bottom
D8  57.53,25.15 90 bottom
D10  59.56,41.4 180 bottom
D11  59.56,45.72 180 bottom
D12  25.27,10.16 0 bottom
D13  25.27,6.1 0 bottom
D14  59.56,37.59 180 bottom
D15  25.27,22.35 0 bottom
IC1  61.47,7.37 270 top
IC2  57.28,6.1 270 bottom
IC3  90.17,44.45 270 bottom
IC4  50.16,45 0 top
IC5  31.88,37.47 180 bottom
IC6  90.17,26.42 270 bottom
IC7  49.53,12.7 270 bottom
IC8  31.11,47.37 180 bottom
IC9  23.24,43.43 0 bottom
IC10  23.5,48.9 145 top
JP1  12.7,34.29 180 top
JP2  87.12,35.05 270 top
JP5  8.13,6.48 0 top
JP6  57.91,35.05 90 top
LED1  61.72,11.75 0 top
LED2  61.72,15.25 0 top
LED3  61.72,18.75 0 top
LED4  61.72,22.25 0 top
LED6  61.72,29.25 0 top
LED7  61.72,32.75 0 top
Q1  [SOT89']  9.4,22.99 0 bottom
Q2  [SOT89']  51.82,44.45 90 bottom
Q3  9.4,21.34 0 bottom
Q4  50.04,44.45 90 bottom
Q5  89.66,17.53 180 top
Q6  91.19,28.7 0 top
Q7  [SOT89']  85.85,5.33 90 bottom
Q8  [SOT89']  72.9,5.08 90 bottom
Q9  MY  [SOT89']  33.02,19.43 0 bottom
Q10  47.37,30.35 90 bottom
R1  32.26,10.16 90 bottom
R2  43.81,10.6 180 bottom
R3  43.81,16.76 0 bottom
R4  67.69,26.29 270 bottom
R5  33.66,25.27 90 bottom
R6  52.2,4.83 0 bottom
R7  51.69,31.37 90 bottom
R8  44.32,4.83 180 bottom
R9  44.2,25.53 0 bottom
R10  53.15,21.46 270 bottom
R11  58.17,10.16 0 bottom
R12  48.2,21.46 270 bottom
R13  10.54,15.24 270 bottom
R14  77.6,26.8 270 bottom
R15  55.5,13.46 180 bottom
R16  58.17,14.8 180 bottom
R17  58.17,19.37 0 bottom
R18  48.9,39.24 180 bottom
R19  51.75,19.24 270 bottom
R20  82.3,15.24 180 bottom
R21  78.49,10.92 180 bottom
R22  71.63,22.1 90 bottom
R23  83.31,35.81 270 bottom
R24  22.86,36.83 270 bottom
R25  49.66,4.83 0 bottom
R26  35.43,40.77 0 bottom
R27  6.86,19.62 90 top
R28  6.86,40.2 90 top
R29  11.18,43.43 90 bottom
R30  11.18,40.51 90 bottom
R31  11.18,37.59 90 bottom
R32  27.43,25.91 270 bottom
R33  30.86,30.48 270 bottom
R34  26.42,38.61 270 bottom
R35  69.09,50.04 90 bottom
R36  11.18,19.62 90 top
R37  11.18,40.2 270 top
R38  92.84,10.03 270 bottom
R39  R_user  [R0805']  92.33,10.79 270 top
T1  89.92,16.64 90 bottom
T3  33.02,14.22 0 bottom
TACHO_BEL  36.07,5.84 0 bottom
TP1  74.93,8.26 0 bottom
TP2  83.82,8.89 0 bottom
TP3  77.79,13.34 0 bottom
TP4  80.33,18.73 0 bottom
TP5  77.79,24.13 0 bottom
TP6  80.33,25.72 0 bottom
TP7  77.47,31.43 0 bottom
TP8  80.33,32.7 0 bottom
TP9  74.93,36.51 0 bottom
TP10  80.33,39.05 0 bottom
TP11  74.61,43.5 0 bottom
TP12  69.53,8.26 0 bottom
TP13  75.69,46.74 0 bottom
TP16  69.53,11.75 0 bottom
TP17  69.53,15.24 0 bottom
TP18  75.25,18.73 0 bottom
TP19  64.14,21.27 0 bottom
TP21  74.93,25.72 0 bottom
TP22  69.53,29.21 0 bottom
TP23  69.53,33.34 0 bottom
TP24  64.45,35.24 0 bottom
TP25  74.87,39.18 0 bottom
TP26  75.18,33.78 0 bottom
U$1  [CE_10.00]  23.37,4.06 0 top
X1  28.64,27.5 270 top
X2  88.27,10.16 90 top
X3  78.42,51.44 180 top

### Tracks (layer width: path | path; a pad name or v marks a point on that pad's centre or on a via)
+10V  (via drill 0.6)
  Top 0.406: v27.56,40.26 27.56,39.5 29.72,37.34 v32.26,37.34
  Bottom 0.406: 26.67,46.35 29.21,48.77 IC8.3 | 26.67,46.35 IC8.16 25.4,44.32 25.15,42.8 24.89,41.91 24.74,41.51 IC9.1 | 27.69,40.26 27.3,39.24 R34.2 | 29.84,46.35 29.97,46.35 30.48,45.97 IC8.13 30.48,42.8 29.59,41.91 28.32,40.77 27.69,40.26 | 29.84,46.35 26.67,46.35 | IC5.4 33.78,38.35 32.77,37.34 v32.26,37.34 31.11,37.34 29.97,36.2 IC5.8 | C7.1 24.51,47.75 25.84,46.55 26.67,46.35 | 27.69,40.26 v27.56,40.26 | IC8.5 31.75,48.64 | 31.75,48.64 31.62,48.13 29.84,46.35 | 31.75,48.64 28.96,48.51
  Bottom 0.61: IC10.OUT 26.1,48.2 25.84,46.55
  pour Bottom: 31.62,48.77 24.64,48.77 24.64,42.8 25.53,42.8 25.53,45.34 25.91,45.72 31.5,45.72 31.5,48.64
+12V  (via drill 0.6)  (2 unrouted)
  Top 0.406: IC1.IN 61.72,5.84 | 66.55,8 66.52,8
  Top 0.61: 75.06,22.1 75.06,22.86 76.83,25.15 76.83,26.8 v73.79,28.83 76.07,30.99 79.88,34.67 81.41,35.05 JP2.2 89.28,35.94 89.15,48.16 v87,50.67 | 75.06,22.1 75.06,21.46 75.31,19.43 75.31,17.65 74.17,17.02 74.17,12.95 75.31,11.56 v75.31,10.92 75.18,10.92 72.9,8.64 67.15,8.64 2.1 | 61.72,5.84 64.52,5.84 66.55,8 | v74.17,22.1 75.06,22.1
  Top 0.711: 41.97,31.47 36.77,31.47
  Top 0.813: v87,50.67 X3.1
  Top 1.016: v54.74,30.99 v43.69,30.99 41.97,31.47 | 36.77,31.47 v35.24,30.92
  Top 1.422: v35.24,30.92 v35.24,29.53
  Bottom 0.406: IC3.16 87,48.9 v87,50.67 | R20.1 79.25,12.45 78.23,11.94 R21.1 | IC2.3 60.48,4.85 61.21,5.33 IC1.IN | Q2.3 48.01,46.76 Q4.3 | Q1.3 7.09,20.07 Q3.3 | R31.2 7.75,37.59 | 7.87,39.88 7.87,39.62 | R30.2 8,40.51 | R29.2 7.75,43.43 | R22.1 v74.17,22.1 | IC10.IN 21.21,48.9 20.57,48.01 20.57,46.61 20.95,46.23 20.95,43.05 20.83,42.93 20.83,42.8
  Bottom 0.61: 2.1 TP12.TP 69.91,8.64 | 70.36,31.37 59.94,31.37 | R21.1 v75.31,10.92 | R32.1 26.54,28.07 | 7.87,39.37 7.87,39.62 8,40.51 8,42.04 12.83,42.04 14.48,43.36 20.27,43.36 20.83,42.8 21.46,42.16 21.72,42.16 21.84,42.04 21.84,41.59 IC9.3
  Bottom 0.711: 70.36,31.37 73.15,28.83 | 59.94,31.37 59.18,30.61
  Bottom 0.813: 73.15,28.83 v73.79,28.83 | 59.18,30.61 55.75,30.61 v54.74,30.99 | Q4.3 44.7,46.74 44.73,41.94 43.92,40.66 43.94,33.53 43.94,31.5 v43.69,30.99 | Q3.3 7.09,19.07 6.48,19.68 6.48,26.04 7.11,26.67 10.41,26.67
  Bottom 1.016: R28.2 6.86,43.69 7.75,43.43 7.75,37.59 7.75,33.53 9.14,31.37 9.14,26.67 10.41,26.67 12.95,26.67 13.99,28.07 X1.6 18.05,29.72 20.45,28.07 26.54,28.07 33.27,28.07 v35.24,29.53
GND  (via drill 0.6)
  Top 0.61: X2.1 92.08,8.89 R39.2
  Top 1.27: v51.82,28.57 45.72,29.34 41.02,29.34
  Bottom 1.27: 37.21,29.53 42.86,29.53
  other vias: 22.48,26.8 72.52,15.11 80.52,36.7 29.72,5.21 58.17,12.7 55.37,27.18 94.36,20.45 94.87,38.48 25.27,16.26 61.72,28.19 49.02,10.16 67.94,3.68 82.3,30.23 54.48,17.14 13.97,51.18 69.72,27.3 66.67,33.66 43.18,43.81 13.72,39.12 25.4,23.37 30.35,16 46.1,37.59 21.21,32.13 23.88,38.23
  pour Bottom (rank 3): 5.08,52.58 95.89,52.58 96.01,9.4 95.5,8.38 86.11,8.38 82.93,8 82.93,2.67 5.08,2.41
  pour Top: 4.57,52.58 95.89,52.58 95.89,2.41 4.57,2.41
N$1  (via drill 0.5, 0.6)  (3 unrouted)
  Top 0.254: JP5.2 v8.13,6.48 8.13,4.83 | JP6.1 v57.91,35.05 JP6.2
  Top 0.61: v30.23,22.86 33.02,22.86 35.81,26.54 36.45,27.51 43.69,27.51 46.35,25.78 53.21,25.78 54.23,28.96 56.13,30.23 | 56.13,32.51 57.53,33.15 JP6.1
  Top 0.813: 56.13,30.23 56.13,32.51 | JP6.1 59.24,36.2 65.46,36.2 2.9
  Bottom 0.406: 57.78,37.32 57.32,37.32 D14.1
  Bottom 0.61: v30.23,22.86 29.46,22.86 29.46,17.27 27.43,14.22 27.43,12.19 | 27.44,5.96 25.4,8.13 21.59,8.13 21.08,7.7 14.22,7.7 11.94,6.1 8.13,5.21 | JP5.2 11.3,7.75 14.99,11.68 21.08,11.68 21.59,12.19 27.43,12.19 | 27.43,12.19 27.43,10.16 D12.1 | JP6.2 56.64,36.91 D14.1
  Bottom 1.016: 64.77,35.24 65.9,35.42 65.94,35.42 2.9
N$2  (via drill 0.6)
  Top 0.406: 36.26,47.32 42.29,47.32 45.21,48.64 61.4,48.64 64.64,47.12 66.55,47.12 67.31,45.85 68.71,45.85 71.63,44.26
  Top 0.61: X1.4 17.85,37.47 20.8,37.47 33.88,47.32 36.26,47.32 | 71.63,44.26 76.26,41.47 78.49,41.47 v80.96,41.91 81.03,41.85 84.58,41.85 86.23,42.74 86.23,48.01 84.77,49.21 81.6,49.21 80.96,49.85 X3.2
  Bottom 0.406: v80.96,41.91 84.45,41.91 85.72,41.27 IC3.10 | R31.1 14.22,37.34
  Bottom 0.61: 14.22,37.34 17.57,37.34 X1.4
N$3  (via drill 0.6)  (3 unrouted)
  Top 0.406: 35.24,49.02 37.02,51.1 59.24,51.1 64.71,48.59 | 64.64,48.64 74.49,48.64 75.75,47.88 78.49,45.59 79.63,45.59 80.87,44.71 | v83.82,44.77 83.5,44.45 81.92,44.45 80.87,44.71 | 78.74,48.9 80.33,47.31 80.33,45.25 80.87,44.71
  Top 0.61: X1.3 18.02,41.59 23.56,41.59 33.02,49.02 35.24,49.02 | X3.3 78.42,49.21 78.74,48.9
  Bottom 0.406: IC3.13 84.77,45.09 84.14,44.77 v83.82,44.77 | 14.22,41.4 13.21,40.64 12.19,40.51
  Bottom 0.61: X1.3 14.27,41.36
N$4  (1 unrouted)
  Top 0.406: 35.88,23.5 41.91,23.5
  Top 0.61: X1.8 33.94,21.56 35.88,23.5 | 41.91,23.5 55.88,23.5 59.05,27.3 60.33,29.08 60.52,29.15
  Bottom 0.406: 2.7 64.77,30.48 61.47,30.48 60.49,29.25
  Bottom 0.61: TP22.TP 66.81,29.21 2.7 | 60.49,29.25 LED6.A
N$5  (via drill 0.6)  (2 unrouted)
  Top 0.61: Q5.3 87.35,17.5 83.31,13.46 81.68,13.46 80.6,12.38 80.6,10.84 v82.04,9.91
  Bottom 0.406: Q8.3 71.88,6.86 79.22,6.86 79.76,7.87 79.76,10.41
  Bottom 0.61: T1.1 85.47,14.35 84.58,13.46 81.28,13.46 79.76,11.43 | v82.04,9.91 80.01,10.67 R21.2
N$6  (1 unrouted)
  Bottom 0.406: IC7.2 53.34,15.24 54.99,16.13 55.37,16.51 56.64,16.51 56.64,20.95 55.88,21.97 55.88,24.89 56.72,25.98 D8.2 | D8.2 57.53,27.81 55.88,28.7 53.72,28.7 52.58,29.84 51.31,29.84 49.53,29.08 47.75,29.08 46.48,29.46 | R22.2 70.74,23.88 64.52,23.88 62.48,25.91 59.01,25.91 D8.2
N$7
  Bottom 0.406: R2.2 46.93,11.49 IC7.10
N$8
  Bottom 1.27: R27.2 R28.1
N$9  (via drill 0.6)  (1 unrouted)
  Top 0.406: v78.23,17.27 78.99,17.27 81.03,16.51 81.03,14.48 79.5,12.7 79.5,10.16 81.79,8.13 v81.79,7.37
  Top 0.61: Q6.3 92.48,27.41 90.55,28.45 86.23,28.45 85.6,26.92 85.6,20.57 81.53,20.57 v78.23,17.27
  Bottom 0.406: v81.79,7.37 82.8,6.86 Q7.3
  Bottom 0.61: T1.3 85.47,17.4 83.57,15.49 83.57,16.51 83.31,16.76 78.74,16.76 v78.23,17.27
N$10  (1 unrouted)
  Bottom 0.61: 92.96,20.07 92.96,17.53
  Bottom 3.175: 89.92,19.56 89.92,17.02
N$11  (via drill 0.6)  (1 unrouted)
  Top 0.813: X1.5 16.8,33.44 14.22,30.86 14.22,27.3 12.45,25.53 12.45,24.38 v12.32,24.26
  Bottom 0.406: Q3.2 9.4,24.26
  Bottom 0.711: 13.84,23.55 22.86,23.55
  Bottom 0.813: D15.2 22.86,22.1 22.86,23.55 | 9.4,24.26 9.65,24.26 v12.32,24.26 13.08,24.26 13.84,23.55
N$12  (1 unrouted)
  Top 0.711: 26.67,7.7 42.04,7.7
  Top 0.813: X1.12 17.79,5.71 21.59,5.71 26.67,7.7 | 42.04,7.7 53.34,7.7 54.99,7.62 56.64,7.62 59.31,10.16 62.36,10.16 LED1.K 2.2
  Bottom 0.61: TP16.TP 2.2 | 18.29,5.71 22.84,5.71 22.84,5.91 D13.2
N$13  (1 unrouted)
  Top 0.406: 62.95,16.43 62.48,16.61 58.93,16.61 57.66,18.29
  Top 0.61: 62.95,15.24 62.95,16.43 | 57.66,18.29 50.48,18.29 42.49,11.67
  Top 0.711: 42.49,11.67 30.11,11.67
  Top 0.813: 2.3 62.95,15.24 | 30.11,11.67 21.43,9.68 X1.11
  Bottom 0.61: TP17.TP 2.3 | X1.11 22.87,9.68 22.87,9.66 22.86,9.65 22.86,9.99 D12.2
N$14  (1 unrouted)
  Top 0.406: 58.04,19.3 59.44,17.42 62.61,17.42 62.93,18.73
  Top 0.61: 43.81,15.61 49.53,19.3 58.04,19.3
  Top 0.711: 36.51,15.61 43.81,15.61
  Top 0.813: X1.10 17.8,13.65 35.24,13.65 36.51,15.61 | 62.93,18.73 70.19,18.75 2.4
  Bottom 0.61: TP18.TP 72.28,18.73 2.4 | X1.10 18.28,13.64 18.29,13.65 22.65,13.65 22.65,13.85 D2.2
N$15  (1 unrouted)
  Bottom 0.406: Q2.2 Q4.2
  Bottom 0.813: IC4.3 52.7,44.2
N$16  (via drill 0.6)
  Top 0.406: v45.97,21.84 v43.31,21.84
  Bottom 0.406: 50.52,10.16 50.52,8.89 IC7.8 | 50.52,10.16 IC7.6 | 50.52,10.16 50.52,11.2 49.02,12.7 49,17.27 46.99,19.94 46.86,20.07 46.23,20.19 v45.97,21.84 | v43.31,21.84 43.18,21.97 43.01,22.79 42.31,23.5 36.32,23.5 34.92,25.02 R5.1
N$17  (via drill 0.6)
  Top 0.406: 30.86,51.56 31.62,51.79 59.63,51.79 64.64,49.47 75.56,49.47 v79.06,46.67
  Top 0.61: X1.2 17.87,45.28 24.64,45.28 30.35,51.31 30.86,51.56 | X3.4 75.56,51.44 75.56,49.47
  Bottom 0.406: IC3.12 84.77,43.81 84.14,43.5 82.55,43.5 79.69,45.09 v79.06,46.67 | R29.1 12.7,43.94 13.97,45.21
  Bottom 0.61: 13.97,45.21 17.53,45.21 X1.2
N$18
  Bottom 0.406: IC3.15 88.9,47.62 89.79,46.61 89.79,39.12 90.55,38.23 90.55,27.3 91.69,25.78 IC6.5
N$19
  Top 0.61: 62.61,46.86 65.09,41.53 66.36,41.53 67.12,40.77 67.5,40.26 70.29,37.4 70.29,34.04 | 71.27,33.02 2.8
  Top 0.813: X1.14 43.58,45.32 45.47,46.86 62.61,46.86 | 70.29,34.04 71.27,33.02
  Bottom 0.406: 69.39,33.19 69.3,32.38 63.18,32.38 63.18,32.56 LED7.K | 62.36,36.98 61.8,37.23 D14.2
  Bottom 0.61: LED7.K 62.36,36.98
  Bottom 1.016: 2.8 TP23.TP 69.39,33.19
N$20  (via drill 0.81)  (1 unrouted)
  Top 0.813: X1.17 41.74,33.31 44.07,32.26 53.34,32.26 54.86,33.4 54.99,37.97 v58.93,40.13
  Bottom 0.813: 64.39,38.23 63.5,39.37 59.94,39.37 v58.93,40.13 57.28,41.38
  Bottom 1.016: 1.9 75.19,36.25 TP9.TP 70.94,36.69 69.22,38.1 65.28,38.1 64.39,38.23
N$21  (via drill 0.6)
  Top 0.61: X1.19 42.98,25.52 45.47,24.64 54.93,24.64 58.36,28.57 v58.61,32.07
  Bottom 0.61: 68.01,47.05 68.01,47.37 60.03,47.37 58.93,45.72 | 58.93,45.72 58.93,43.05 55.24,40.51 55.24,33.66 56.33,32.58 v58.61,32.07 | D11.1 58.93,45.72
  Bottom 1.016: 68.01,47.05 69.09,45.97 70.17,43.5 TP11.TP 74.93,43.18 76.8,43.18 1.11
N$22
  Bottom 0.406: IC8.11 32.89,45.85 33.4,46.35 34.92,46.35 | 34.92,46.35 35.43,45.85 IC8.9 | 34.92,46.35 34.92,46.61 35.56,47.3 42.67,47.3 43.69,47.8 44.2,49.78 46.86,51.18 60.07,51.18 60.82,50.69 61.59,50.04 R35.2
N$23
  Bottom 0.406: R1.2 31.5,11.18 32.13,11.81 35.05,11.81 36.96,13.46
  Bottom 0.61: 36.96,13.46 39.48,13.46 X1.22
N$24  (1 unrouted)
  Bottom 0.406: IC7.11 42.8,12.7 41.91,11.68 36.58,11.68 34.54,10.16 R1.1 C8.1
N$25
  Bottom 0.406: IC6.13 83.95,27.05
  Bottom 0.61: TP6.TP 83.03,25.72 1.6 83.95,27.05
N$26
  Bottom 0.406: 80.78,29.25 1.7 | IC6.14 82.51,28.32
  Bottom 0.61: TP7.TP 77.47,29.34 1.7 | 82.51,28.32 80.78,29.25
N$27  (via drill 0.6)  (1 unrouted)
  Top 0.406: 73.03,35.94 72.14,36.83 69.47,39.62 68.96,40.89 | 62.93,20.64 62.1,20.09 59.44,20.09 59.05,20.19 | v43.81,18.8 44.58,19.05 44.57,19.06
  Top 0.508: 73.03,35.94 73.79,34.8 | 68.71,20.64 62.93,20.64 | 59.05,20.19 49.28,20.19 44.57,19.06
  Top 0.61: 68.71,20.64 70.74,21.78 73.91,23.62 74.8,24.51 74.8,26.67 72.26,28.32 72.26,29.84 74.3,30.86 74.93,31.88 74.93,33.66 73.79,34.8 v71.88,34.92 | 2.11 66.77,43.09 68.96,40.89
  Bottom 0.406: 73.41,34.67 74.93,34.16 TP26.TP 75.95,34.16 78.74,34.16 81.41,35.81 R23.1 | R3.1 v43.81,18.8
  Bottom 0.61: 73.34,34.67 v71.88,34.92
N$28  (1 unrouted)
  Bottom 0.406: 52.7,31.62 54.36,29.46 58.42,29.46 60.96,26.92 63.25,26.92 65.53,24.64 70.1,24.64 71.22,25.75 2.6 | R14.1 76.01,26.8 TP21.TP
  Bottom 0.61: TP21.TP 72.3,25.72 2.6
N$29
  Bottom 0.406: R23.2 84.2,36.58 85.22,37.59
  Bottom 0.61: 85.22,37.59 JP2.1
N$30
  Bottom 0.406: R25.2 C5.1 45.72,5.71 | IC7.9 45.59,10.03 45.09,9.4 45.09,7.24 45.72,6.6 45.72,5.71 | 45.72,5.71 R8.2
N$31
  Bottom 0.406: R9.2 44.32,23.88 | 44.32,23.88 44.32,19.81 46.1,18.03 46.1,16.58 IC7.14 | 44.32,23.88 45.47,23.88 C9.2
N$32
  Bottom 0.406: R24.1 C1.2 22.23,33.1 D3.2 25.82,32.89 28.96,32.89 | IC5.2 31.24,38.73 28.96,36.45 28.96,32.89 | 28.96,32.89 31.62,32.89 32.51,33.27 IC5.6
N$34
  Bottom 0.61: LED6.K 64.62,27.85 R4.1
N$35  (via drill 0.6)
  Top 0.711: 44.2,35.41 36.64,35.41
  Top 0.813: 44.2,35.41 45.72,35.43 IC4.1
  Top 1.016: 36.64,35.41 35.92,35.41 33.27,32.51 33.27,29.21 27.94,26.67 | 27.94,26.67 26.58,25.42 17.88,25.42 X1.7 | 27.94,26.67 v31.24,26.67
  Bottom 0.61: v31.24,26.67 31.12,26.8 R5.2 | R18.1 47.6,39.27 IC4.1
N$36
  Bottom 0.406: R9.1 44.96,28.19 44.96,40.13 46.25,41.94 46.74,41.94 Q4.1 49.02,42.14 Q2.1
N$37  (via drill 0.6)
  Top 0.406: 90.93,49.02 91.44,48.51 91.44,37.59 91.19,37.34 91.19,34.54 94.74,33.4 94.74,23.5 v90.93,23.5
  Top 0.61: v90.42,49.53 90.93,49.02
  Bottom 0.406: IC3.2 91.76,47.62 v90.42,49.53 | IC6.7 91.19,23.24 v90.93,23.5
N$38
  Bottom 0.406: 1.3 77.6,15.25 77.09,16.01 77.09,17.78 79.63,20.45 82.17,20.45 85.85,24.51 IC6.11
  Bottom 0.61: TP3.TP 77.79,15.02 1.3
N$39
  Bottom 0.406: 1.5 80.16,22.25 81.27,23.37 83.57,23.37 84.84,24.64 85.47,25.4 85.85,25.78 IC6.12
  Bottom 0.61: 1.5 77.56,23.9 TP5.TP
N$41
  Top 0.508: 64.39,28.07 64.39,30.1
  Top 0.61: LED1.A LED2.A | 64.39,28.07 64.39,27.69 62.23,24 LED4.A | 64.39,30.1 63.5,31.24 61.96,31.24 LED7.A
  Bottom 0.61: LED1.A 60.45,11.43 59.94,10.92 58.36,10.92 R11.1 | LED2.A LED3.A LED4.A
N$42
  Bottom 0.406: X1.16 37.02,36.51 36.58,35.18 35.56,32.51 34.54,32.51 33.27,30.61 R33.2
N$43
  Bottom 0.406: Q1.1 11.71,20.04 Q3.1 11.43,17.96 R13.2
N$44
  Bottom 0.406: IC6.2 IC6.1 93.6,31.52 93.6,36.2 90.68,39.24 90.68,45.47 91.57,46.35 IC3.3
N$45
  Bottom 0.406: C2.1 52.38,22.58 R10.1 R12.2
N$46  (1 unrouted)
  Bottom 0.406: 52.05,12.7 50.29,12.7 49.78,13.46 49.78,17.78 48.01,20.32 R12.1 48.01,22.89 C3.1
N$47
  Bottom 0.406: R17.2 R16.2 57.4,15.37 56.9,14.86 56.9,13.21 R15.1 54.99,11.43 IC7.5
N$48
  Bottom 0.406: Q10.3 49.53,30.35 R7.2
N$49
  Bottom 0.406: R17.1 57.78,20.32 57.78,22.53 D8.1
N$50  (via drill 0.6)
  Top 0.406: v92.46,35.43 92.26,35.18 92.32,35.23
  Top 0.61: 92.32,35.23 92.33,36.13 92.33,50.29 v92.71,50.8
  Bottom 0.406: IC6.4 91.89,27.05 91.44,27.69 91.44,33.59 v92.46,35.43
  Bottom 0.61: v92.71,50.8 92.71,48.9 IC3.1
N$51
  Top 0.406: 13.97,2.79 43.18,2.79
N$52
  Bottom 0.406: 1.8 83.11,32.7 | IC6.16 85.89,30.92 83.19,32.7
  Bottom 0.61: TP8.TP 83.01,32.7 | 83.19,32.7 83.01,32.7 | 83.01,32.7 1.8
N$53  (via drill 0.6)
  Top 0.813: X1.15 51.94,44.9 61.72,44.9 63.5,40.39 64.9,39.69 v65.41,39.69
  Bottom 0.61: TP25.TP 72.2,39.69
  Bottom 0.813: v65.41,39.69 72.2,39.69 2.10
N$54
  Bottom 0.61: 27.32,19.16 27.32,18.48 D1.1
  Bottom 0.711: 20.83,19.56 13.59,19.56
  Bottom 1.016: 27.32,19.16 26.16,20.32 21.59,20.32 20.83,19.56 | 13.59,19.56 13.59,12.83 8.13,12.83
  Bottom 1.27: 8.13,12.83 6.86,11.43 R27.1
N$55
  Top 0.406: LED4.K 61.78,20.93 59.56,20.93 59.18,21.21 | 42.07,19.53 36.04,19.53 35.81,19.56
  Top 0.61: 2.5 LED4.K | 59.18,21.21 48.92,21.21 45.72,20.45 43.94,20.45 42.26,19.53 42.07,19.53 | X1.9 17.92,17.46 21.59,17.46 27.18,20.32 34.04,20.32 34.8,19.56 35.81,19.56
  Bottom 0.61: TP19.TP 64.14,21.36 65.02,22.25 2.5 | X1.9 22.66,17.6 22.66,17.92 D1.2
N$56  (1 unrouted)
  Bottom 0.406: IC3.14 88.27,46.35 88.9,45.72 88.9,38.86 89.66,37.85 89.66,26.8 91.57,24.51 93.34,24.51
N$57  (via drill 0.6)  (3 unrouted)
  Top 0.406: Q6.2 89.66,25.65 89.66,22.4 91.19,22.4 Q5.1
  Top 0.61: X2.2 v90.49,11.49 92.08,11.75 | Q6.1 Q6.2 | Q5.1 91.97,18.44 T1.6 93.02,13.26 92.46,12.7 92.46,11.87 R39.1
  Bottom 0.406: v90.49,11.49 94.74,11.75 94.74,17.27 94.36,17.4 | Q8.1 71.88,3.05 82.09,3.05 Q7.1 | 87.38,11.43 X2.2
  Bottom 0.61: T1.2 89.15,15.88 90.68,17.4 | T1.4 89.41,18.92 | X2.2 90.17,11.43 | 90.17,11.43 v90.49,11.49 | 90.17,11.43 92.01,11.43 R38.1 | 90.68,17.4 T1.6 94.36,17.4 | 90.68,17.4 89.41,18.92 | 86.11,9.91 87.38,11.43 | Q7.1 83.67,5.08 Q7.2 | 86.11,5.33 90.68,5.33 | 86.87,3.56 86.87,5.59 | 87.63,5.08 87.63,7.11 | 86.74,19 86.74,20.32 | 89.41,18.92 92.96,18.92
  Bottom 0.813: 86.11,5.33 86.11,9.91
  Bottom 1.27: 86.06,20.45 92.71,20.45
  pour Bottom: 82.55,7.62 93.98,7.62 93.98,2.54 82.55,2.54
N$58
  Top 0.61: X1.24 36.45,5.72 TACHO_BEL.TP
N$59  (1 unrouted)
  Top 0.61: Q5.2 89.66,14.99 87.68,14.99 84.59,11.89 83.2,11.89 1.2
  Bottom 0.406: Q8.2 79.5,5.08 81.03,8.64 83.57,8.64 TP2.TP
  Bottom 0.61: TP2.TP 83.69,10.92 83.69,11.55 1.2 85.09,11.94 86.87,12.95 88.65,12.95 89.92,14.22 93.22,14.22 93.09,14.35 | T1.8 93.09,14.35 | 93.09,15.75 93.09,14.35 | 91.69,15.62 92.58,15.88 | 74.93,4.19 76.33,4.19 | 74.93,5.97 76.33,5.97
  pour Bottom: 72.14,6.35 78.99,6.35 80.26,7.62 80.77,17.02 94.49,17.02 94.49,11.94 86.87,11.94 82.8,7.87 82.8,7.62 82.3,7.11 82.3,3.3 72.14,3.3
N$60
  Bottom 0.254: 58.17,23.88 58.17,26.42
N$61  (1 unrouted)
  Bottom 0.305: 93.22,28.32 94.87,28.32 94.87,31.75 94.49,32.26
  Bottom 0.406: 94.49,32.26 94.49,36.58 91.52,39.56 91.52,42.55 IC3.6
N$63
  Bottom 1.422: 35.18,29.72 35.18,30.86
N$64
  Bottom 0.61: IC4.2 R18.2
N$65
  Bottom 0.406: 34.16,35.05 IC5.5 33.78,36.52 34.42,37.47 35.31,38.35 R26.2
N$67
  Bottom 0.406: IC6.10 85.85,23.24 84.84,21.97 84.84,20.53 1.4
  Bottom 0.61: TP4.TP 83.04,18.73 1.4
N$69
  Top 0.406: 13.97,3.17 43.37,3.17
  Top 0.508: 57.21,4.13 65.91,4.13
  Top 0.813: 12.19,12.95 13.08,12.83 13.08,4.51 13.97,3.17 | 46.74,3.75 51.18,3.81 56.13,3.68 57.21,4.13
  Top 1.016: X1.1 15.49,49.21 13.59,47.62 13.59,44.01 9.02,39.37 9.02,21.84 6.6,19.43 6.6,12.95 12.19,12.95 | 43.37,3.17 46.74,3.75 | 65.91,4.13 67.75,5.78 73.43,5.78 1.1
  Bottom 0.61: TP1.TP 1.1
N$70
  Top 0.813: 74.68,29.21 74.68,28.7
N$83
  Bottom 0.406: 51.05,5.84 51.05,7.24 IC7.7 | 49.97,6.03 R25.1 49.78,5.84 51.05,5.84 | 51.05,5.84 52.07,5.84 R6.1
N$84  (via drill 0.6)
  Top 0.61: X1.21 31.68,17.6 v31.11,19.05
  Bottom 0.406: 44.32,15.62 R3.2 43.31,15.88 41.66,17.53 39.71,17.53 X1.21 | Q9.2 T3.C
  Bottom 0.61: v31.11,19.05 33.02,19.05 Q9.2
N$85  (1 unrouted)
  Bottom 0.406: IC7.13 45.47,15.24 44.7,14.48 42.93,14.48 42.16,15.62 34.62,15.62 | R32.2 29.34,25.4 32.26,23.37 34.04,23.37 35.05,22.35 35.05,17.78 Q9.1 34.54,16.56 34.54,14.97 T3.B
N$86
  Bottom 0.406: R26.1 35.05,41.91 32.51,41.91 | 32.51,41.91 IC5.3 | IC8.12 31.75,42.67 32.51,41.91
N$87
  Bottom 0.406: R33.1 27.94,30.52 D3.1
N$88  (via drill 0.6)
  Top 0.406: v84.07,30.23 81.53,27.69 80.52,27.69 79.76,26.92 79.76,24.13 80.52,23.37 80.52,21.84 76.71,18.03 76.71,17.53 75.18,16 75.18,14.22 76.96,12.45 76.96,10.92 72.9,6.86 66.8,6.86 64.77,4.9 59.44,4.9 57.66,6.6 44.96,6.6 42.16,3.89 14.99,3.89 14.22,4.83 14.22,14.48 13.46,15.24 v8.13,15.24
  Bottom 0.406: IC6.15 86.97,29.46 85.34,29.46 84.58,30.23 v84.07,30.23 | R13.1 v8.13,15.24
N$89
  Bottom 0.406: IC8.14 29.21,42.93 26.42,41.15 26.42,40.01 25.53,39.24 R34.1 | 25.53,38.35 R34.1 | C10.1 27.3,35.94 25.53,37.72 R34.1
N$90  (1 unrouted)
  Bottom 0.254: R35.1 68.45,50.04
  Bottom 0.406: 69.98,49.91 70.87,48.53 2.12 72.27,46.74 TP13.TP
N$91  (via drill 1 pad 1.93)
  other vias: 60.58,25.15
N$93  (via drill 0.6)
  Top 0.711: 41.78,39.37 36.45,39.37 | 32.64,35.41 14.73,35.41
  Top 0.813: v60.71,43.69 52.32,43.69 41.78,39.37 | 36.45,39.37 32.64,35.41 | 14.73,35.41 13.31,35.41 JP1.1
  Bottom 0.813: D11.2 60.75,43.56 D10.2 61.72,41.4 v60.71,43.69
  Bottom 1.016: 1.10 TP10.TP 77.98,39.12 76.59,40.51 74.61,41.59 69.85,41.59 69.53,41.27 63.75,41.27 63.25,43.56
  Bottom 1.93: 63.25,43.56 60.75,43.56
N$94  (via drill 0.5)
  Top 0.254: JP1.2 v12.7,34.29 12.7,35.31
  Top 0.813: R36.2 11.18,29.97 R37.2 11.18,32.77 11.43,33.02 JP1.2
N$95  (1 unrouted)
N$580  (1 unrouted)
  Bottom 0.406: 51.69,16.51 52.7,17.53 52.7,18.73 R19.2 53.97,20.45 R10.2
VCC  (via drill 0.6)
  Top 0.61: v55.5,9.53 55.5,15.11 v55.88,15.62
  Bottom 0.406: R19.1 50.74,18.73 50.57,17.65 50.57,13.97 IC7.3 54.36,13.97 54.86,14.48 54.93,14.48 R15.2 | R6.2 53.59,4.83 53.59,8 54.48,8 54.73,8.25 54.73,8.76 | IC2.1 59.28,8.23 60.07,8.64
  Bottom 0.61: v55.88,15.62 R15.2 | 60.07,9.4 58.17,9.4 | 58.17,9.4 56.64,9.4 | C4.1 62.23,8.64 | R11.2 58.17,9.4
  Bottom 0.813: 60.07,9.4 60.07,8.64 IC1.OUT 62.23,8.64 | 56.64,9.4 55.37,9.4 | 55.37,9.4 v55.5,9.53 | 54.73,8.76 55.37,9.4

### Text on the board
Top: top | BEP V3.0 / maru-labs.com
tPlace: QC
bPlace: 4 | 3 | 2 | 1 | b | c | 5 | a | 5 | 4 | 3 | 1 | 2
tNames: GND c b a 12V | GND / BT / HiB | RPM | RPM / SPD / HiB | disable / BL / Resistor | 18 | disable / Bulb Test / on WRN | 19< | 2.7 / 2.6 | 1.12 GND / 1.11< / 1.10<> / 1.9 > / 1.8 N / 1.7 G5 / 1.6 _G4 / 1.5 G3 / 1.4 G2 / 1.3 G1 | 1.2 CC | disable / Choke / on WRN | BT / ABS / BAR / ALT / TMP / OIL / CHK / SWP | 1.1 BAT | 1BAT / 2 GC / 3 GB / 4 GA / / 6SWP / 7 RES / 8 ABS / 9 ALT / 10 TMP / OIL | CHK | 2.12 / 2.11 / 2.10 / 2.9 / / / / 2.5 / 2.4 / 2.3 / 2.2 / 2.1 | 13 / 14 / 15 / 16 / 17> / / / / 21 SPDin / 22 SPDout / 23 / 24
bNames: 78L10 | N | N | BSS138 | < / / > / / G5 / / G3 / / G1 / / / BAT | GND / / <> / / N / / G4 / / G2 / / CC | 78L06
tValues: set jumper for / motoscope tiny / support
bValues: BA | BA | or4701 | 6,8 | 2.4V/1.1V | 4 | 13 GND / 14 BT / 15 HiB / 16 RPM / 17 > / 18 GND / 19 < / / 21 SPD in / 22 SPD o / 23 GND | 6V | SPD / / WRN / / ABS / / ALT / / OIL / / SWP | RPM / / HiB / / BT / / BAR / / TMP / / CHK | 4.7V | BA | BA | 1 BAT / 2 GC / 3 GB / 4 GA / 5 START / 6 SWP / 7R ES / 8A BS / 9 / 10 TMP / 11 OIL / 12CH K
tStop: BEP V3.0 / maru-labs.com